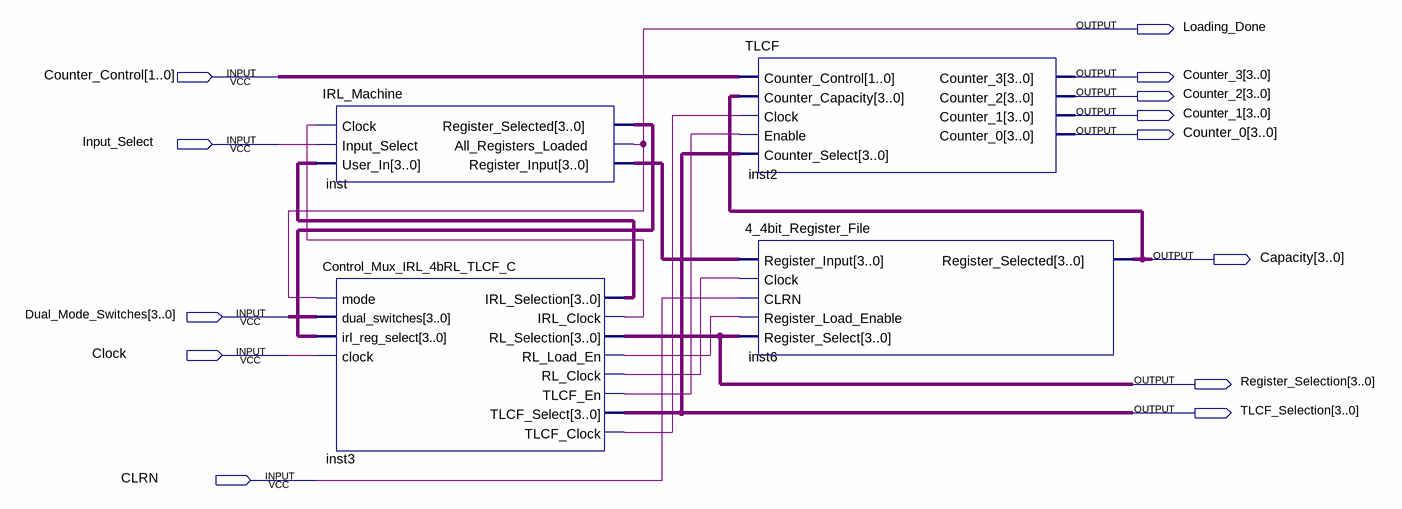
[diagram p0: schematic sheet]
// Quartus schematic IRL_4bRL_TLCF_C.bdf as structural Verilog: 4 symbols, 13 pins
module IRL_4bRL_TLCF_C (
  input  [1:0] Counter_Control,
  input  Input_Select,
  input  [3:0] Dual_Mode_Switches,
  input  Clock,
  input  CLRN,
  output Loading_Done,
  output [3:0] Counter_3,
  output [3:0] Counter_2,
  output [3:0] Counter_1,
  output [3:0] Counter_0,
  output [3:0] Capacity,
  output [3:0] Register_Selection,
  output [3:0] TLCF_Selection
);

  wire inst3_irl_clock, inst3_rl_clock, inst3_rl_load_en, inst3_tlcf_clock, inst3_tlcf_en;
  wire [3:0] inst3_irl_selection, inst_register_input, inst_register_selected;

  IRL_Machine inst (
    .Clock(inst3_irl_clock), .Input_Select(Input_Select), .User_In(inst3_irl_selection),
    .Register_Selected(inst_register_selected), .All_Registers_Loaded(Loading_Done),
    .Register_Input(inst_register_input));
  Control_Mux_IRL_4bRL_TLCF_C inst3 (
    .mode(Loading_Done), .dual_switches(Dual_Mode_Switches), .irl_reg_select(inst_register_selected),
    .clock(Clock), .IRL_Selection(inst3_irl_selection), .IRL_Clock(inst3_irl_clock),
    .RL_Selection(Register_Selection), .RL_Load_En(inst3_rl_load_en), .RL_Clock(inst3_rl_clock),
    .TLCF_En(inst3_tlcf_en), .TLCF_Select(TLCF_Selection), .TLCF_Clock(inst3_tlcf_clock));
  TLCF inst2 (
    .Counter_Control(Counter_Control), .Counter_Capacity(Capacity), .Clock(inst3_tlcf_clock),
    .Enable(inst3_tlcf_en), .Counter_Select(TLCF_Selection), .Counter_3(Counter_3), .Counter_2(Counter_2),
    .Counter_1(Counter_1), .Counter_0(Counter_0));
  \4_4bit_Register_File  inst6 (
    .Register_Input(inst_register_input), .Clock(inst3_rl_clock), .CLRN(CLRN),
    .Register_Load_Enable(inst3_rl_load_en), .Register_Select(Register_Selection),
    .Register_Selected(Capacity));
endmodule
